# EAGLE schematic RGBLineSensor_Host (EAGLE 9.4.2)
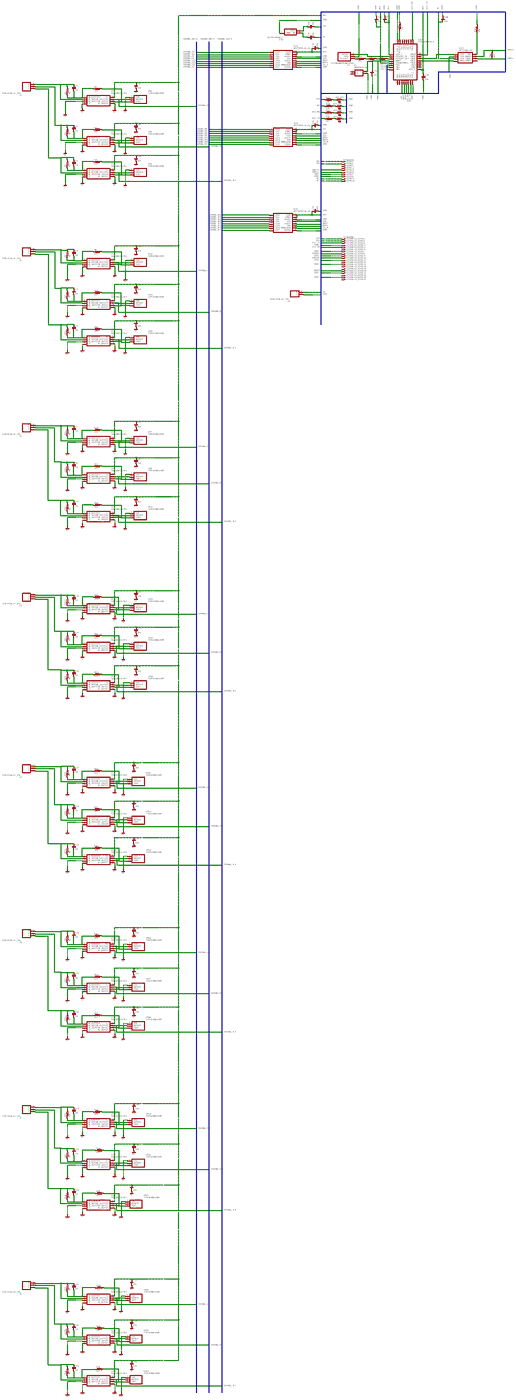
[diagram p0: schematic, sheet 1, overview]
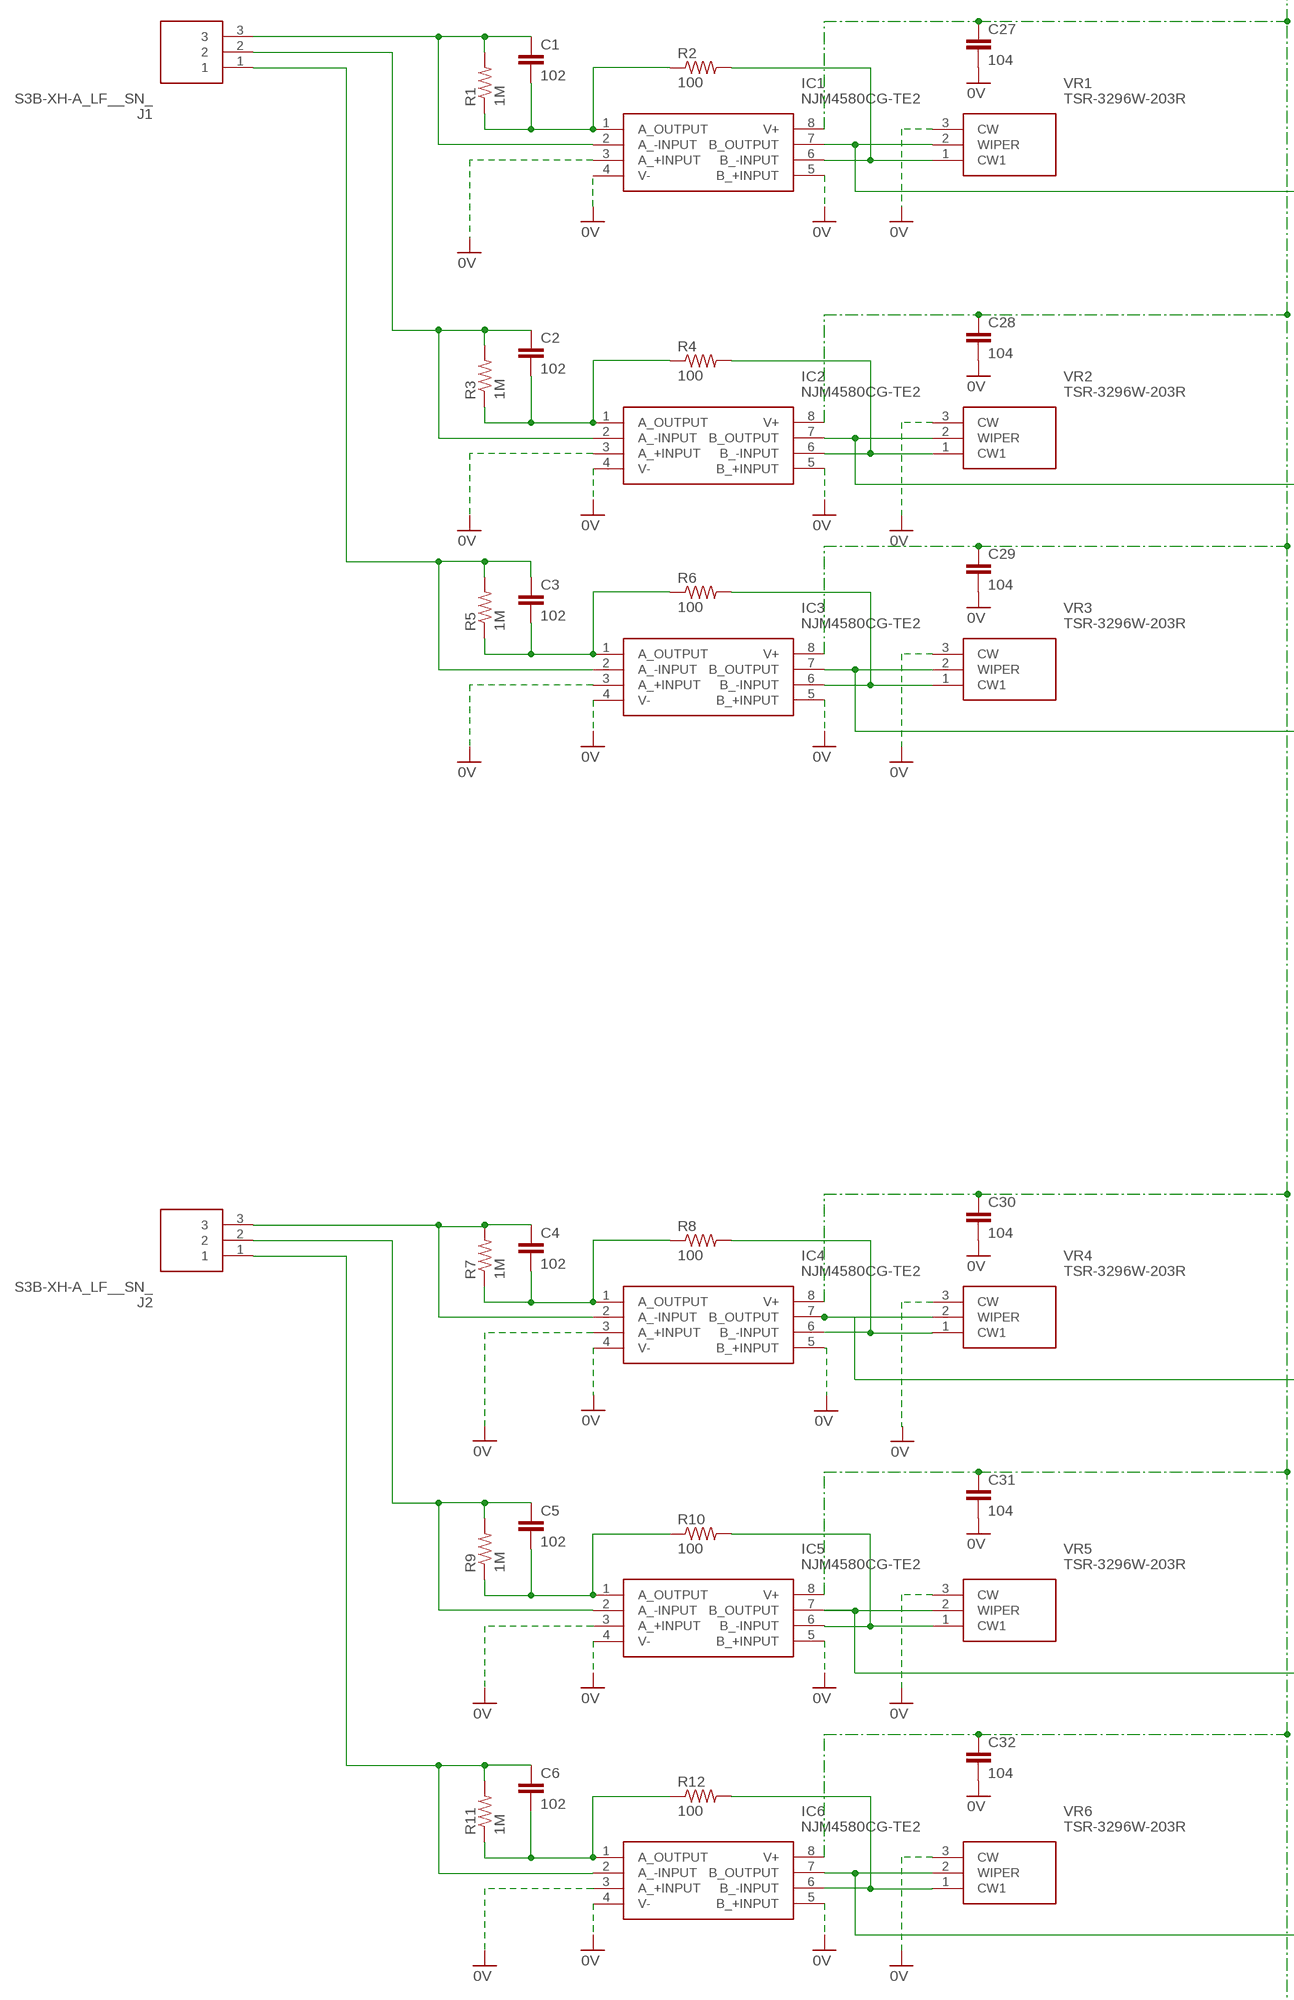
[diagram p1: schematic, sheet 1, part 1 of 5]
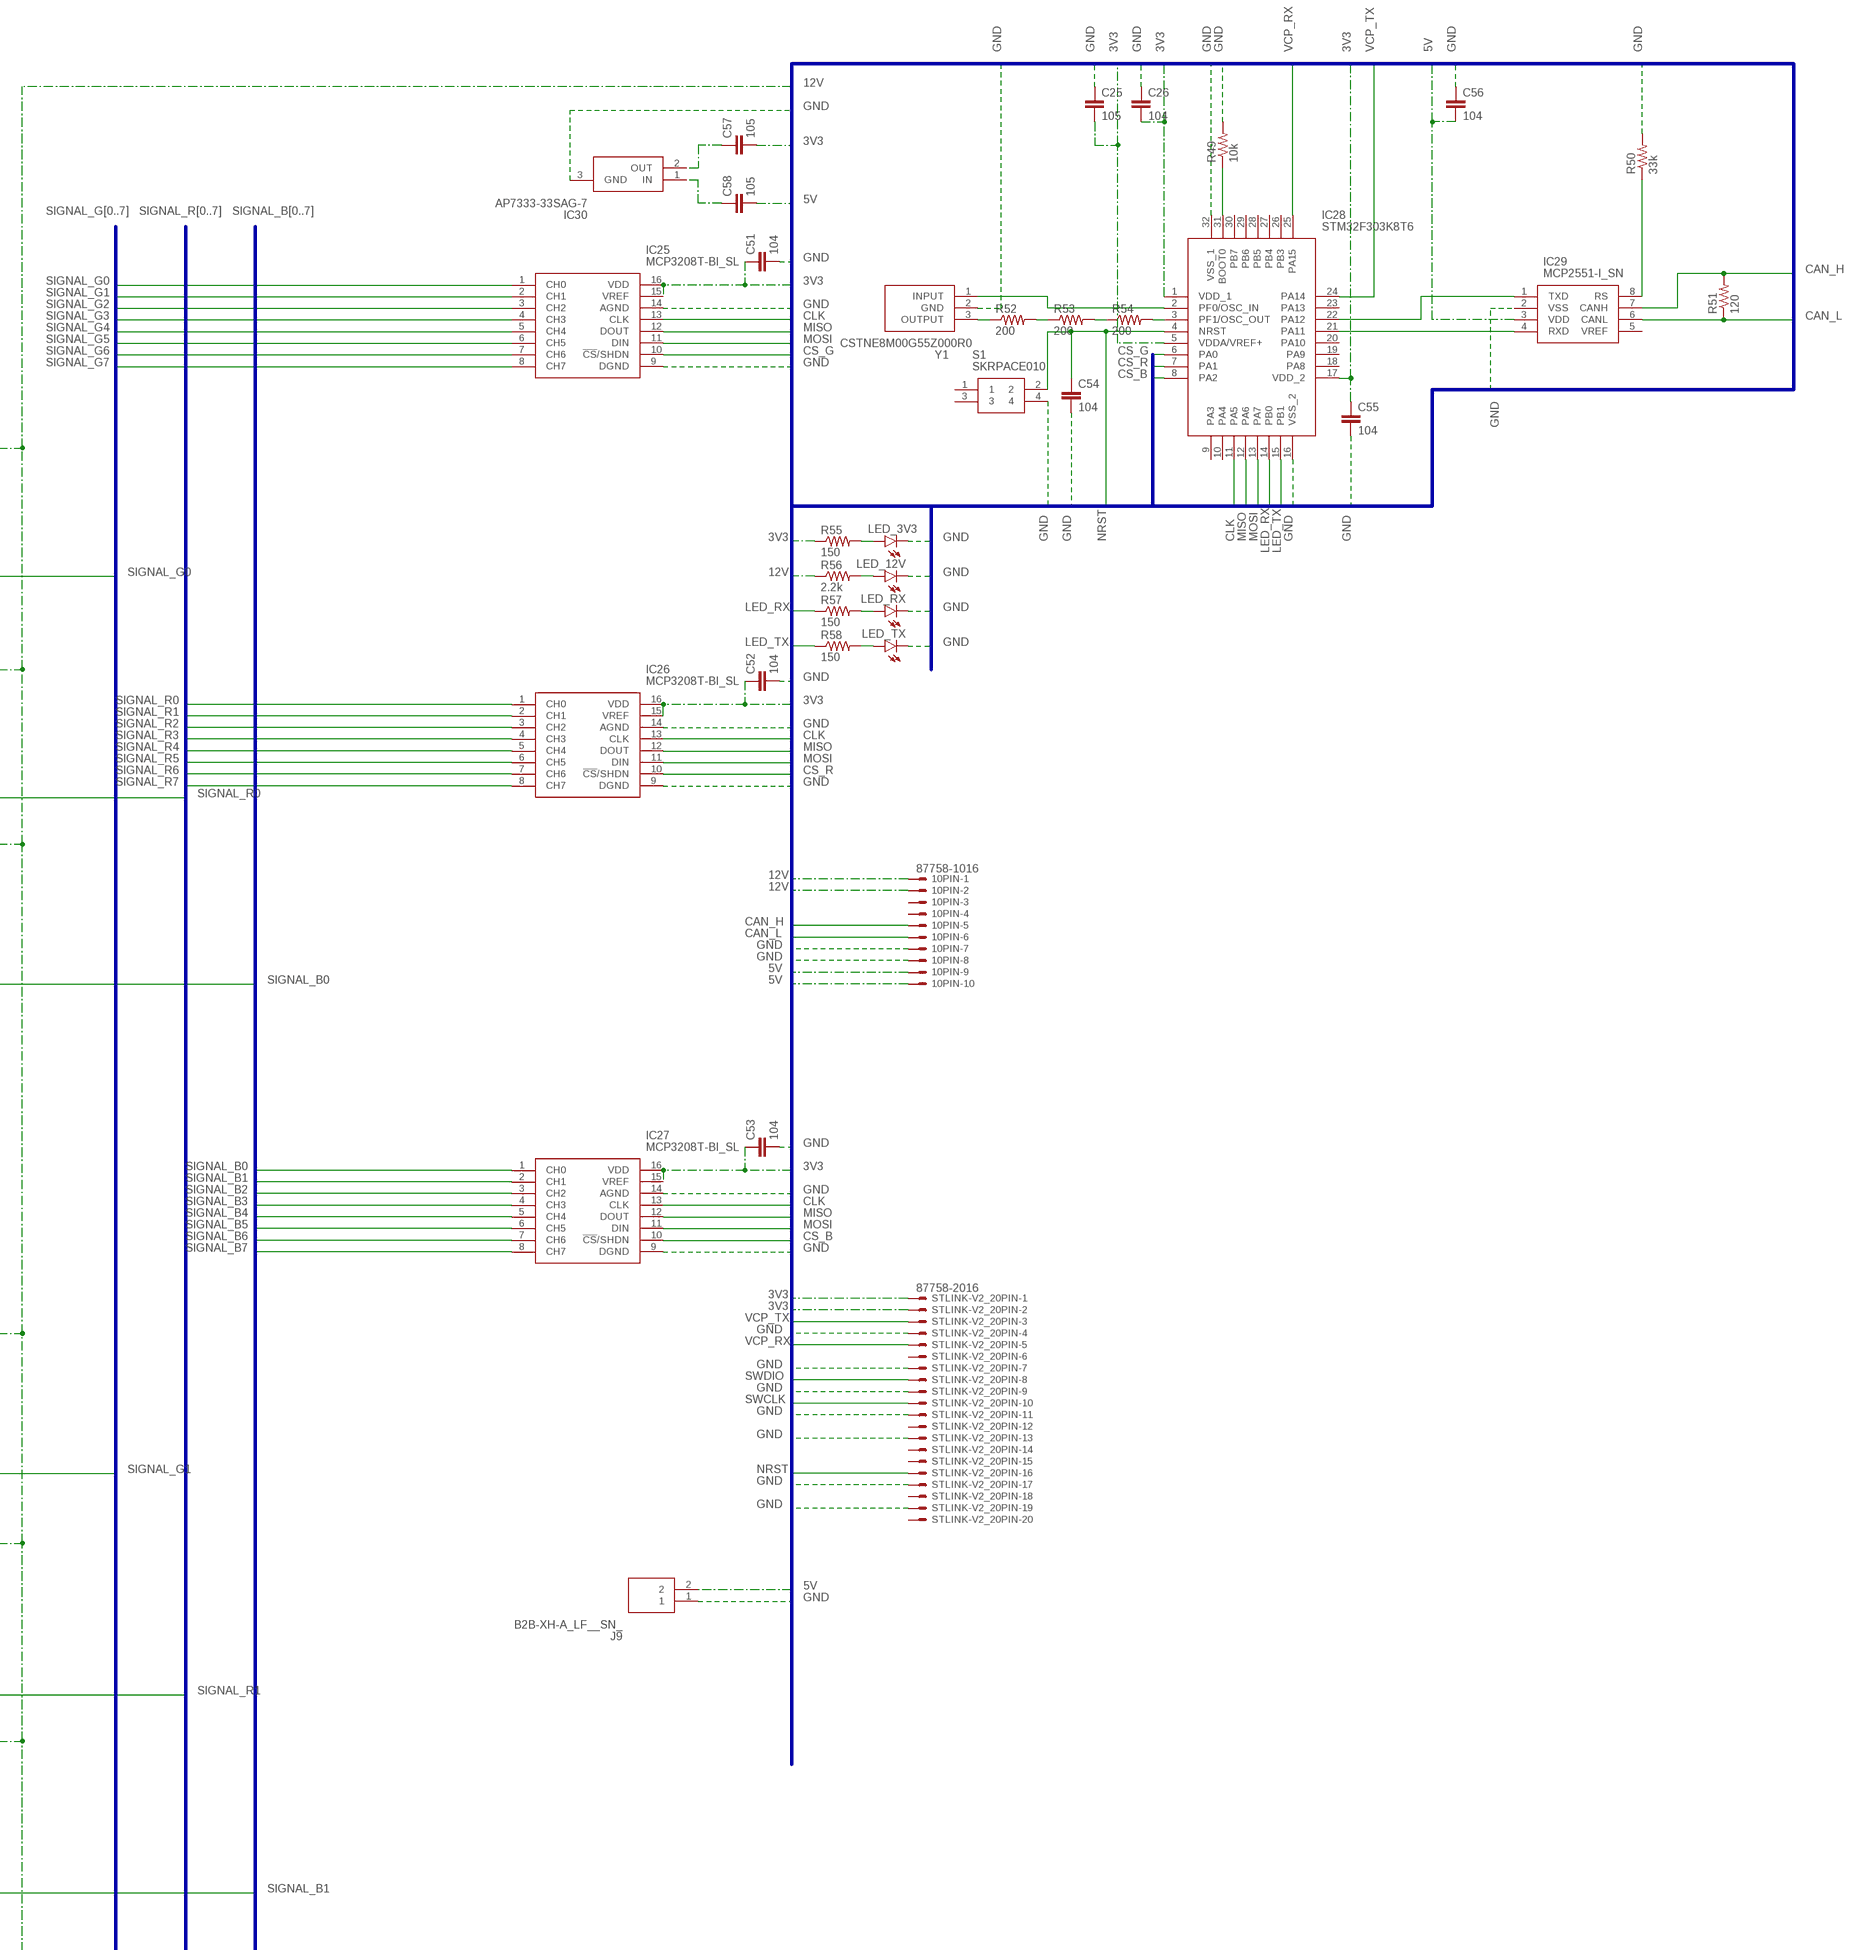
[diagram p2: schematic, sheet 1, part 2 of 5]
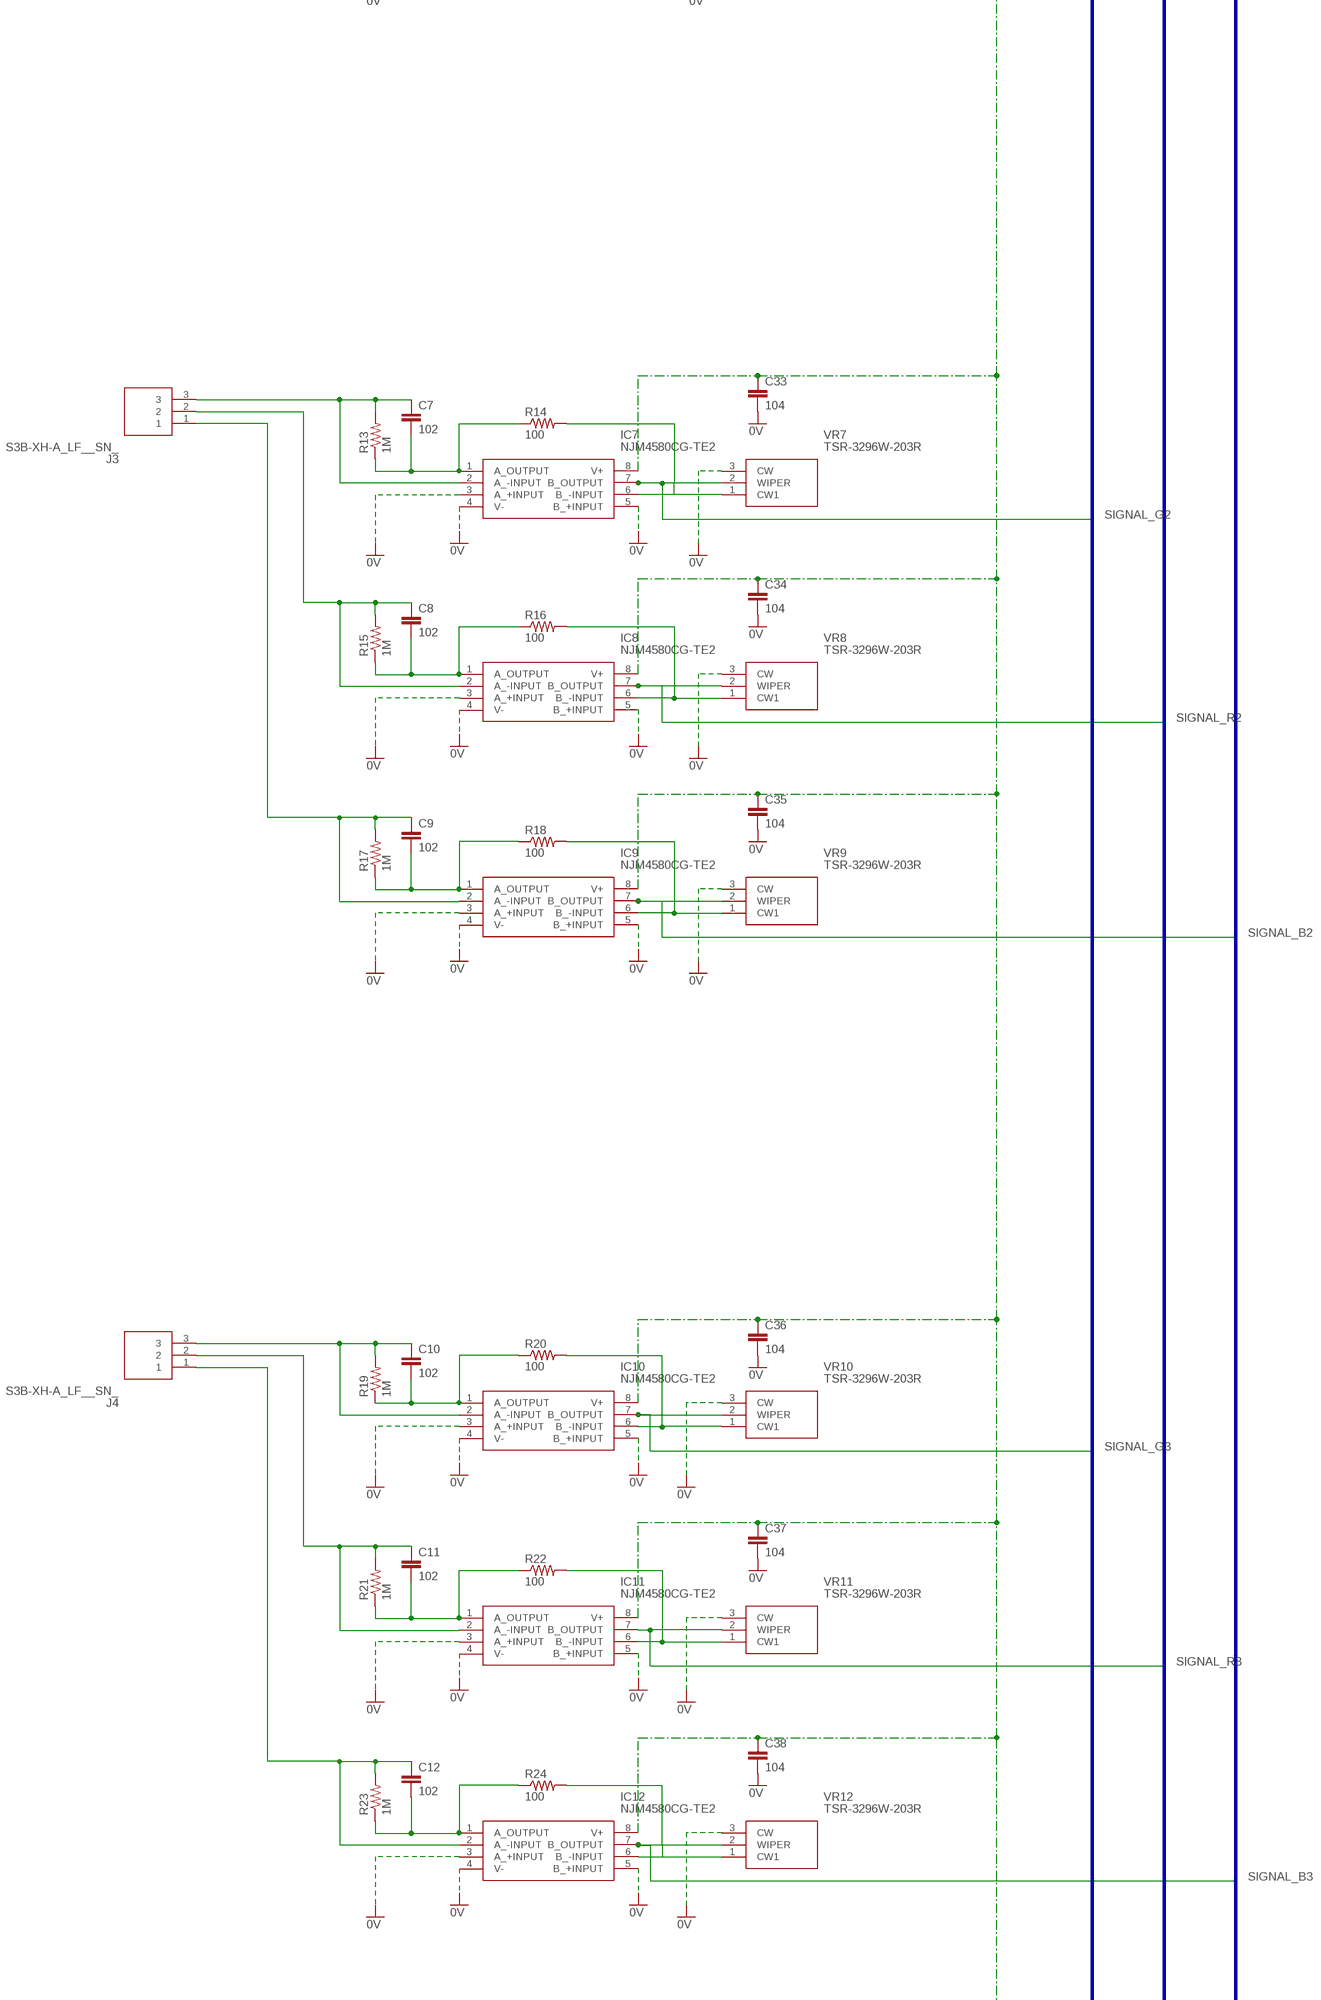
[diagram p3: schematic, sheet 1, part 3 of 5]
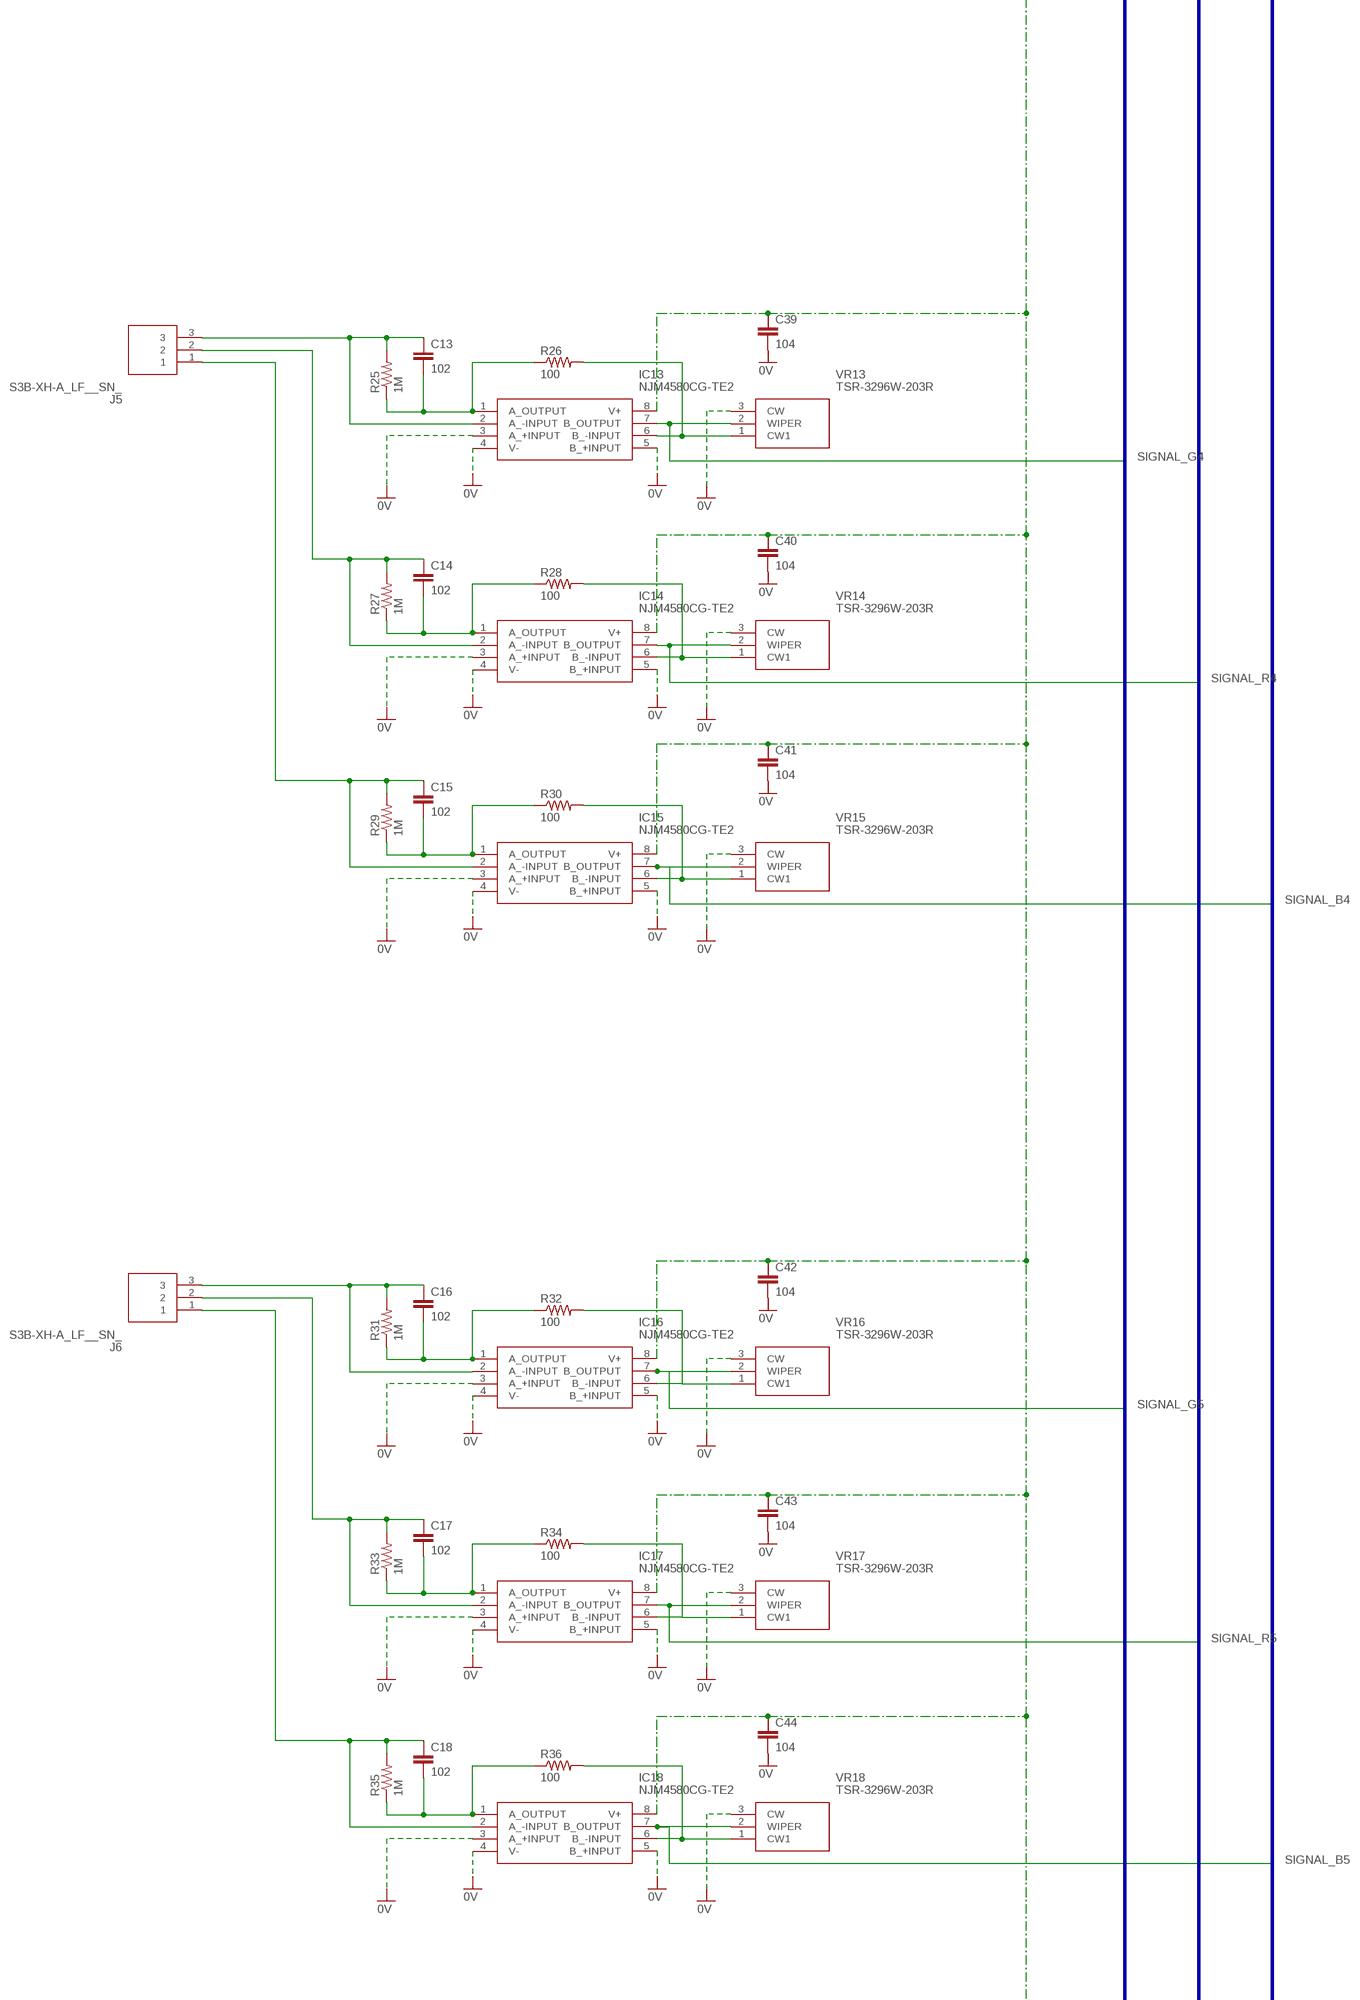
[diagram p4: schematic, sheet 1, part 4 of 5]
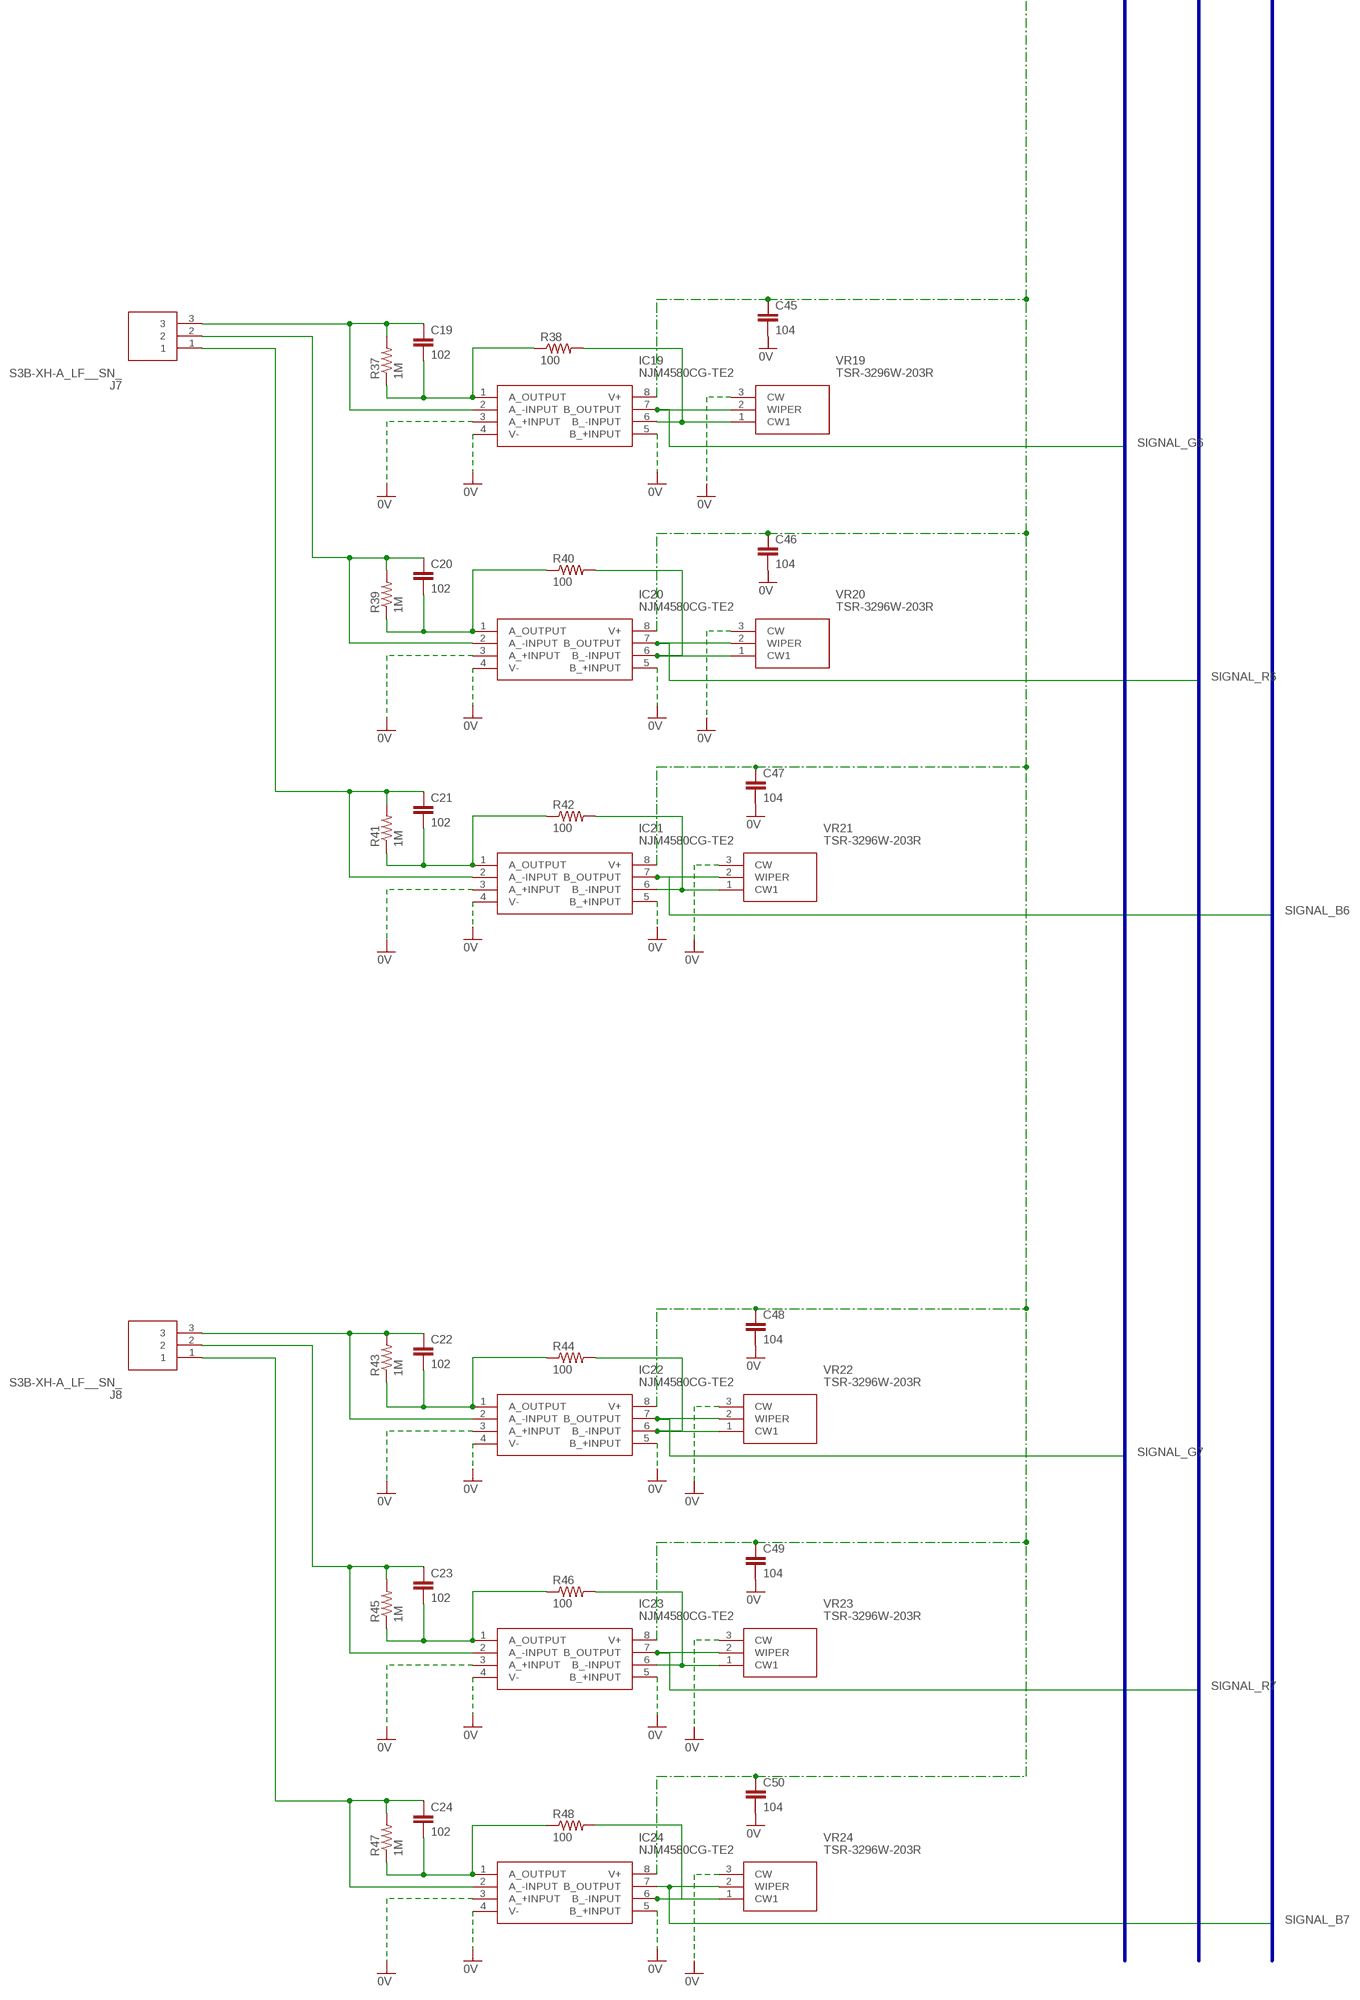
[diagram p5: schematic, sheet 1, part 5 of 5]

## Parts
10PIN  87758-1016  [87758-1016]
C1  102  C-EUC1608  [C1608]
C2  102  C-EUC1608  [C1608]
C3  102  C-EUC1608  [C1608]
C4  102  C-EUC1608  [C1608]
C5  102  C-EUC1608  [C1608]
C6  102  C-EUC1608  [C1608]
C7  102  C-EUC1608  [C1608]
C8  102  C-EUC1608  [C1608]
C9  102  C-EUC1608  [C1608]
C10  102  C-EUC1608  [C1608]
C11  102  C-EUC1608  [C1608]
C12  102  C-EUC1608  [C1608]
C13  102  C-EUC1608  [C1608]
C14  102  C-EUC1608  [C1608]
C15  102  C-EUC1608  [C1608]
C16  102  C-EUC1608  [C1608]
C17  102  C-EUC1608  [C1608]
C18  102  C-EUC1608  [C1608]
C19  102  C-EUC1608  [C1608]
C20  102  C-EUC1608  [C1608]
C21  102  C-EUC1608  [C1608]
C22  102  C-EUC1608  [C1608]
C23  102  C-EUC1608  [C1608]
C24  102  C-EUC1608  [C1608]
C25  105  C-EUC1608  [C1608]
C26  104  C-EUC1608  [C1608]
C27  104  C-EUC1608  [C1608]
C28  104  C-EUC1608  [C1608]
C29  104  C-EUC1608  [C1608]
C30  104  C-EUC1608  [C1608]
C31  104  C-EUC1608  [C1608]
C32  104  C-EUC1608  [C1608]
C33  104  C-EUC1608  [C1608]
C34  104  C-EUC1608  [C1608]
C35  104  C-EUC1608  [C1608]
C36  104  C-EUC1608  [C1608]
C37  104  C-EUC1608  [C1608]
C38  104  C-EUC1608  [C1608]
C39  104  C-EUC1608  [C1608]
C40  104  C-EUC1608  [C1608]
C41  104  C-EUC1608  [C1608]
C42  104  C-EUC1608  [C1608]
C43  104  C-EUC1608  [C1608]
C44  104  C-EUC1608  [C1608]
C45  104  C-EUC1608  [C1608]
C46  104  C-EUC1608  [C1608]
C47  104  C-EUC1608  [C1608]
C48  104  C-EUC1608  [C1608]
C49  104  C-EUC1608  [C1608]
C50  104  C-EUC1608  [C1608]
C51  104  C-EUC1608  [C1608]
C52  104  C-EUC1608  [C1608]
C53  104  C-EUC1608  [C1608]
C54  104  C-EUC1608  [C1608]
C55  104  C-EUC1608  [C1608]
C56  104  C-EUC1608  [C1608]
C57  105  C-EUC1608  [C1608]
C58  105  C-EUC1608  [C1608]
IC1  NJM4580CG-TE2  [SOIC127P600X175-8N]
IC2  NJM4580CG-TE2  [SOIC127P600X175-8N]
IC3  NJM4580CG-TE2  [SOIC127P600X175-8N]
IC4  NJM4580CG-TE2  [SOIC127P600X175-8N]
IC5  NJM4580CG-TE2  [SOIC127P600X175-8N]
IC6  NJM4580CG-TE2  [SOIC127P600X175-8N]
IC7  NJM4580CG-TE2  [SOIC127P600X175-8N]
IC8  NJM4580CG-TE2  [SOIC127P600X175-8N]
IC9  NJM4580CG-TE2  [SOIC127P600X175-8N]
IC10  NJM4580CG-TE2  [SOIC127P600X175-8N]
IC11  NJM4580CG-TE2  [SOIC127P600X175-8N]
IC12  NJM4580CG-TE2  [SOIC127P600X175-8N]
IC13  NJM4580CG-TE2  [SOIC127P600X175-8N]
IC14  NJM4580CG-TE2  [SOIC127P600X175-8N]
IC15  NJM4580CG-TE2  [SOIC127P600X175-8N]
IC16  NJM4580CG-TE2  [SOIC127P600X175-8N]
IC17  NJM4580CG-TE2  [SOIC127P600X175-8N]
IC18  NJM4580CG-TE2  [SOIC127P600X175-8N]
IC19  NJM4580CG-TE2  [SOIC127P600X175-8N]
IC20  NJM4580CG-TE2  [SOIC127P600X175-8N]
IC21  NJM4580CG-TE2  [SOIC127P600X175-8N]
IC22  NJM4580CG-TE2  [SOIC127P600X175-8N]
IC23  NJM4580CG-TE2  [SOIC127P600X175-8N]
IC24  NJM4580CG-TE2  [SOIC127P600X175-8N]
IC25  MCP3208T-BI_SL  [SOIC127P600X175-16N]
IC26  MCP3208T-BI_SL  [SOIC127P600X175-16N]
IC27  MCP3208T-BI_SL  [SOIC127P600X175-16N]
IC28  STM32F303K8T6  [QFP80P900X900X160-32N]
IC29  MCP2551-I_SN  [SOIC127P600X175-8N]
IC30  AP7333-33SAG-7  [SOT96P240X135-3N]
J1  S3B-XH-A_LF__SN_  [SHDRRA3W80P0X250_1X3_990X1150X]
J2  S3B-XH-A_LF__SN_  [SHDRRA3W80P0X250_1X3_990X1150X]
J3  S3B-XH-A_LF__SN_  [SHDRRA3W80P0X250_1X3_990X1150X]
J4  S3B-XH-A_LF__SN_  [SHDRRA3W80P0X250_1X3_990X1150X]
J5  S3B-XH-A_LF__SN_  [SHDRRA3W80P0X250_1X3_990X1150X]
J6  S3B-XH-A_LF__SN_  [SHDRRA3W80P0X250_1X3_990X1150X]
J7  S3B-XH-A_LF__SN_  [SHDRRA3W80P0X250_1X3_990X1150X]
J8  S3B-XH-A_LF__SN_  [SHDRRA3W80P0X250_1X3_990X1150X]
J9  B2B-XH-A_LF__SN_  [SHDR2W64P0X250_1X2_740X575X700]
LED_3V3  LEDCHIP-LED0603  [CHIP-LED0603]
LED_12V  LEDCHIP-LED0603  [CHIP-LED0603]
LED_RX  LEDCHIP-LED0603  [CHIP-LED0603]
LED_TX  LEDCHIP-LED0603  [CHIP-LED0603]
R1  1M  R-US_R0603  [R0603]
R2  100  R-US_R0603  [R0603]
R3  1M  R-US_R0603  [R0603]
R4  100  R-US_R0603  [R0603]
R5  1M  R-US_R0603  [R0603]
R6  100  R-US_R0603  [R0603]
R7  1M  R-US_R0603  [R0603]
R8  100  R-US_R0603  [R0603]
R9  1M  R-US_R0603  [R0603]
R10  100  R-US_R0603  [R0603]
R11  1M  R-US_R0603  [R0603]
R12  100  R-US_R0603  [R0603]
R13  1M  R-US_R0603  [R0603]
R14  100  R-US_R0603  [R0603]
R15  1M  R-US_R0603  [R0603]
R16  100  R-US_R0603  [R0603]
R17  1M  R-US_R0603  [R0603]
R18  100  R-US_R0603  [R0603]
R19  1M  R-US_R0603  [R0603]
R20  100  R-US_R0603  [R0603]
R21  1M  R-US_R0603  [R0603]
R22  100  R-US_R0603  [R0603]
R23  1M  R-US_R0603  [R0603]
R24  100  R-US_R0603  [R0603]
R25  1M  R-US_R0603  [R0603]
R26  100  R-US_R0603  [R0603]
R27  1M  R-US_R0603  [R0603]
R28  100  R-US_R0603  [R0603]
R29  1M  R-US_R0603  [R0603]
R30  100  R-US_R0603  [R0603]
R31  1M  R-US_R0603  [R0603]
R32  100  R-US_R0603  [R0603]
R33  1M  R-US_R0603  [R0603]
R34  100  R-US_R0603  [R0603]
R35  1M  R-US_R0603  [R0603]
R36  100  R-US_R0603  [R0603]
R37  1M  R-US_R0603  [R0603]
R38  100  R-US_R0603  [R0603]
R39  1M  R-US_R0603  [R0603]
R40  100  R-US_R0603  [R0603]
R41  1M  R-US_R0603  [R0603]
R42  100  R-US_R0603  [R0603]
R43  1M  R-US_R0603  [R0603]
R44  100  R-US_R0603  [R0603]
R45  1M  R-US_R0603  [R0603]
R46  100  R-US_R0603  [R0603]
R47  1M  R-US_R0603  [R0603]
R48  100  R-US_R0603  [R0603]
R49  10k  R-US_R0603  [R0603]
R50  33k  R-US_R0603  [R0603]
R51  120  R-US_R0603  [R0603]
R52  200  R-US_R0603  [R0603]
R53  200  R-US_R0603  [R0603]
R54  200  R-US_R0603  [R0603]
R55  150  R-US_R0603  [R0603]
R56  2.2k  R-US_R0603  [R0603]
R57  150  R-US_R0603  [R0603]
R58  150  R-US_R0603  [R0603]
S1  SKRPACE010  [SMT(4.2X3.2)]
STLINK-V2_20PIN  87758-2016  [87758-2016]
VR1  TSR-3296W-203R  [TSR3296W203R]
VR2  TSR-3296W-203R  [TSR3296W203R]
VR3  TSR-3296W-203R  [TSR3296W203R]
VR4  TSR-3296W-203R  [TSR3296W203R]
VR5  TSR-3296W-203R  [TSR3296W203R]
VR6  TSR-3296W-203R  [TSR3296W203R]
VR7  TSR-3296W-203R  [TSR3296W203R]
VR8  TSR-3296W-203R  [TSR3296W203R]
VR9  TSR-3296W-203R  [TSR3296W203R]
VR10  TSR-3296W-203R  [TSR3296W203R]
VR11  TSR-3296W-203R  [TSR3296W203R]
VR12  TSR-3296W-203R  [TSR3296W203R]
VR13  TSR-3296W-203R  [TSR3296W203R]
VR14  TSR-3296W-203R  [TSR3296W203R]
VR15  TSR-3296W-203R  [TSR3296W203R]
VR16  TSR-3296W-203R  [TSR3296W203R]
VR17  TSR-3296W-203R  [TSR3296W203R]
VR18  TSR-3296W-203R  [TSR3296W203R]
VR19  TSR-3296W-203R  [TSR3296W203R]
VR20  TSR-3296W-203R  [TSR3296W203R]
VR21  TSR-3296W-203R  [TSR3296W203R]
VR22  TSR-3296W-203R  [TSR3296W203R]
VR23  TSR-3296W-203R  [TSR3296W203R]
VR24  TSR-3296W-203R  [TSR3296W203R]
Y1  CSTNE8M00G55Z000R0  [CSTNE8M00G55Z000R0]

## Nets
0V: C27.2 C28.2 C29.2 C30.2 C31.2 C32.2 C33.2 C34.2 C35.2 C36.2 C37.2 C38.2 C39.2 C40.2 C41.2 C42.2 C43.2 C44.2 C45.2 C46.2 C47.2 C48.2 C49.2 C50.2 IC1.3(A_+INPUT) IC1.4(V-) IC1.5(B_+INPUT) IC2.3(A_+INPUT) IC2.4(V-) IC2.5(B_+INPUT) IC3.3(A_+INPUT) IC3.4(V-) IC3.5(B_+INPUT) IC4.3(A_+INPUT) IC4.4(V-) IC4.5(B_+INPUT) IC5.3(A_+INPUT) IC5.4(V-) IC5.5(B_+INPUT) IC6.3(A_+INPUT) IC6.4(V-) IC6.5(B_+INPUT) IC7.3(A_+INPUT) IC7.4(V-) IC7.5(B_+INPUT) IC8.3(A_+INPUT) IC8.4(V-) IC8.5(B_+INPUT) IC9.3(A_+INPUT) IC9.4(V-) IC9.5(B_+INPUT) IC10.3(A_+INPUT) IC10.4(V-) IC10.5(B_+INPUT) IC11.3(A_+INPUT) IC11.4(V-) IC11.5(B_+INPUT) IC12.3(A_+INPUT) IC12.4(V-) IC12.5(B_+INPUT) IC13.3(A_+INPUT) IC13.4(V-) IC13.5(B_+INPUT) IC14.3(A_+INPUT) IC14.4(V-) IC14.5(B_+INPUT) IC15.3(A_+INPUT) IC15.4(V-) IC15.5(B_+INPUT) IC16.3(A_+INPUT) IC16.4(V-) IC16.5(B_+INPUT) IC17.3(A_+INPUT) IC17.4(V-) IC17.5(B_+INPUT) IC18.3(A_+INPUT) IC18.4(V-) IC18.5(B_+INPUT) IC19.3(A_+INPUT) IC19.4(V-) IC19.5(B_+INPUT) IC20.3(A_+INPUT) IC20.4(V-) IC20.5(B_+INPUT) IC21.3(A_+INPUT) IC21.4(V-) IC21.5(B_+INPUT) IC22.3(A_+INPUT) IC22.4(V-) IC22.5(B_+INPUT) IC23.3(A_+INPUT) IC23.4(V-) IC23.5(B_+INPUT) IC24.3(A_+INPUT) IC24.4(V-) IC24.5(B_+INPUT) VR1.3(CW) VR2.3(CW) VR3.3(CW) VR4.3(CW) VR5.3(CW) VR6.3(CW) VR7.3(CW) VR8.3(CW) VR9.3(CW) VR10.3(CW) VR11.3(CW) VR12.3(CW) VR13.3(CW) VR14.3(CW) VR15.3(CW) VR16.3(CW) VR17.3(CW) VR18.3(CW) VR19.3(CW) VR20.3(CW) VR21.3(CW) VR22.3(CW) VR23.3(CW) VR24.3(CW)
3V3: C25.2 C26.2 C51.1 C52.1 C53.1 C55.1 C57.2 IC25.15(VREF) IC25.16(VDD) IC26.15(VREF) IC26.16(VDD) IC27.15(VREF) IC27.16(VDD) IC28.1(VDD_1) IC28.5(VDDA/VREF+) IC28.17(VDD_2) R55.1 STLINK-V2_20PIN.1 STLINK-V2_20PIN.2
5V: 10PIN.9 10PIN.10 C56.2 C58.2 IC29.3(VDD) J9.2
12V: 10PIN.1 10PIN.2 C27.1 C28.1 C29.1 C30.1 C31.1 C32.1 C33.1 C34.1 C35.1 C36.1 C37.1 C38.1 C39.1 C40.1 C41.1 C42.1 C43.1 C44.1 C45.1 C46.1 C47.1 C48.1 C49.1 C50.1 IC1.8(V+) IC2.8(V+) IC3.8(V+) IC4.8(V+) IC5.8(V+) IC6.8(V+) IC7.8(V+) IC8.8(V+) IC9.8(V+) IC10.8(V+) IC11.8(V+) IC12.8(V+) IC13.8(V+) IC14.8(V+) IC15.8(V+) IC16.8(V+) IC17.8(V+) IC18.8(V+) IC19.8(V+) IC20.8(V+) IC21.8(V+) IC22.8(V+) IC23.8(V+) IC24.8(V+) R56.1
CAN_H: 10PIN.5 IC29.7(CANH) R51.2
CAN_L: 10PIN.6 IC29.6(CANL) R51.1
CLK: IC25.13(CLK) IC26.13(CLK) IC27.13(CLK) IC28.11(PA5)
CS_B: IC27.10(!CS!/SHDN) IC28.8(PA2)
CS_G: IC25.10(!CS!/SHDN) IC28.6(PA0)
CS_R: IC26.10(!CS!/SHDN) IC28.7(PA1)
GND: 10PIN.7 10PIN.8 C25.1 C26.1 C51.2 C52.2 C53.2 C54.2 C55.2 C56.1 IC25.9(DGND) IC25.14(AGND) IC26.9(DGND) IC26.14(AGND) IC27.9(DGND) IC27.14(AGND) IC28.16(VSS_2) IC28.32(VSS_1) IC29.2(VSS) IC30.3(GND) J9.1 LED_3V3.C LED_12V.C LED_RX.C LED_TX.C R49.2 R50.2 S1.4 STLINK-V2_20PIN.4 STLINK-V2_20PIN.7 STLINK-V2_20PIN.9 STLINK-V2_20PIN.11 STLINK-V2_20PIN.13 STLINK-V2_20PIN.17 STLINK-V2_20PIN.19 Y1.2(GND)
LED_RX: IC28.14(PB0) R57.1
LED_TX: IC28.15(PB1) R58.1
MISO: IC25.12(DOUT) IC26.12(DOUT) IC27.12(DOUT) IC28.12(PA6)
MOSI: IC25.11(DIN) IC26.11(DIN) IC27.11(DIN) IC28.13(PA7)
N$1: C1.1 IC1.2(A_-INPUT) J1.3 R1.2
N$2 [power]: C57.1 IC30.2(OUT)
N$3: C1.2 IC1.1(A_OUTPUT) R1.1 R2.1
N$4: C7.1 IC7.2(A_-INPUT) J3.3 R13.2
N$5: IC1.6(B_-INPUT) R2.2 VR1.1(CW1)
N$6: IC28.22(PA12) IC29.1(TXD)
N$7: C2.2 IC2.1(A_OUTPUT) R3.1 R4.1
N$8: C2.1 IC2.2(A_-INPUT) J1.2 R3.2
N$9: IC2.6(B_-INPUT) R4.2 VR2.1(CW1)
N$10: IC28.21(PA11) IC29.4(RXD)
N$11: C3.2 IC3.1(A_OUTPUT) R5.1 R6.1
N$12: C7.2 IC7.1(A_OUTPUT) R13.1 R14.1
N$13: IC3.6(B_-INPUT) R6.2 VR3.1(CW1)
N$14: IC29.8(RS) R50.1
N$15: C4.1 IC4.2(A_-INPUT) J2.3 R7.2
N$16: C3.1 IC3.2(A_-INPUT) J1.1 R5.2
N$17: C4.2 IC4.1(A_OUTPUT) R7.1 R8.1
N$18: IC6.6(B_-INPUT) R12.2 VR6.1(CW1)
N$19: IC10.6(B_-INPUT) R20.2 VR10.1(CW1)
N$20: IC8.6(B_-INPUT) R16.2 VR8.1(CW1)
N$21: IC9.6(B_-INPUT) R18.2 VR9.1(CW1)
N$22: IC11.6(B_-INPUT) R22.2 VR11.1(CW1)
N$23: IC13.6(B_-INPUT) R26.2 VR13.1(CW1)
N$24: IC24.6(B_-INPUT) R48.2 VR24.1(CW1)
N$25: C5.1 IC5.2(A_-INPUT) J2.2 R9.2
N$26: C5.2 IC5.1(A_OUTPUT) R9.1 R10.1
N$27: IC14.6(B_-INPUT) R28.2 VR14.1(CW1)
N$28: IC16.6(B_-INPUT) R32.2 VR16.1(CW1)
N$29: IC5.6(B_-INPUT) R10.2 VR5.1(CW1)
N$30: IC18.6(B_-INPUT) R36.2 VR18.1(CW1)
N$31: IC15.6(B_-INPUT) R30.2 VR15.1(CW1)
N$32: IC23.6(B_-INPUT) R46.2 VR23.1(CW1)
N$33: C6.2 IC6.1(A_OUTPUT) R11.1 R12.1
N$35: IC21.6(B_-INPUT) R42.2 VR21.1(CW1)
N$36: C24.1 IC24.2(A_-INPUT) J8.1 R47.2
N$37: IC28.31(BOOT0) R49.1
N$38: C6.1 IC6.2(A_-INPUT) J2.1 R11.2
N$39: R52.1 Y1.3(OUTPUT)
N$40: IC22.6(B_-INPUT) R44.2 VR22.1(CW1)
N$41: C24.2 IC24.1(A_OUTPUT) R47.1 R48.1
N$42: C8.1 IC8.2(A_-INPUT) J3.2 R15.2
N$43: C8.2 IC8.1(A_OUTPUT) R15.1 R16.1
N$44: C9.2 IC9.1(A_OUTPUT) R17.1 R18.1
N$45: IC17.6(B_-INPUT) R34.2 VR17.1(CW1)
N$46 [power]: C58.1 IC30.1(IN)
N$47: C22.2 IC22.1(A_OUTPUT) R43.1 R44.1
N$48: LED_3V3.A R55.2
N$49: R52.2 R53.1
N$50: C9.1 IC9.2(A_-INPUT) J3.1 R17.2
N$51: IC4.6(B_-INPUT) R8.2 VR4.1(CW1)
N$52: C10.1 IC10.2(A_-INPUT) J4.3 R19.2
N$53: IC19.6(B_-INPUT) R38.2 VR19.1(CW1)
N$54: R53.2 R54.1
N$55: C10.2 IC10.1(A_OUTPUT) R19.1 R20.1
N$56: IC28.3(PF1/OSC_OUT) R54.2
N$57: C11.1 IC11.2(A_-INPUT) J4.2 R21.2
N$58: C11.2 IC11.1(A_OUTPUT) R21.1 R22.1
N$59: IC20.6(B_-INPUT) R40.2 VR20.1(CW1)
N$62: IC28.2(PF0/OSC_IN) Y1.1(INPUT)
N$63: IC12.6(B_-INPUT) R24.2 VR12.1(CW1)
N$64: IC7.6(B_-INPUT) R14.2 VR7.1(CW1)
N$68: C12.2 IC12.1(A_OUTPUT) R23.1 R24.1
N$71: LED_12V.A R56.2
N$72: C16.1 IC16.2(A_-INPUT) J6.3 R31.2
N$73: C13.1 IC13.2(A_-INPUT) J5.3 R25.2
N$74: C13.2 IC13.1(A_OUTPUT) R25.1 R26.1
N$75: C12.1 IC12.2(A_-INPUT) J4.1 R23.2
N$76: C14.1 IC14.2(A_-INPUT) J5.2 R27.2
N$79: LED_RX.A R57.2
N$81: C14.2 IC14.1(A_OUTPUT) R27.1 R28.1
N$85: C15.1 IC15.2(A_-INPUT) J5.1 R29.2
N$86: LED_TX.A R58.2
N$87: C15.2 IC15.1(A_OUTPUT) R29.1 R30.1
N$88: C16.2 IC16.1(A_OUTPUT) R31.1 R32.1
N$94: C17.1 IC17.2(A_-INPUT) J6.2 R33.2
N$96: C17.2 IC17.1(A_OUTPUT) R33.1 R34.1
N$103: C19.1 IC19.2(A_-INPUT) J7.3 R37.2
N$104: C18.2 IC18.1(A_OUTPUT) R35.1 R36.1
N$105: C18.1 IC18.2(A_-INPUT) J6.1 R35.2
N$107: C19.2 IC19.1(A_OUTPUT) R37.1 R38.1
N$111: C20.1 IC20.2(A_-INPUT) J7.2 R39.2
N$112: C20.2 IC20.1(A_OUTPUT) R39.1 R40.1
N$118: C21.2 IC21.1(A_OUTPUT) R41.1 R42.1
N$123: C21.1 IC21.2(A_-INPUT) J7.1 R41.2
N$125: C23.1 IC23.2(A_-INPUT) J8.2 R45.2
N$132: C23.2 IC23.1(A_OUTPUT) R45.1 R46.1
N$139: C22.1 IC22.2(A_-INPUT) J8.3 R43.2
NRST: C54.1 IC28.4(NRST) S1.2 STLINK-V2_20PIN.16
SIGNAL_B0: IC3.7(B_OUTPUT) IC27.1(CH0) VR3.2(WIPER)
SIGNAL_B1: IC6.7(B_OUTPUT) IC27.2(CH1) VR6.2(WIPER)
SIGNAL_B2: IC9.7(B_OUTPUT) IC27.3(CH2) VR9.2(WIPER)
SIGNAL_B3: IC12.7(B_OUTPUT) IC27.4(CH3) VR12.2(WIPER)
SIGNAL_B4: IC15.7(B_OUTPUT) IC27.5(CH4) VR15.2(WIPER)
SIGNAL_B5: IC18.7(B_OUTPUT) IC27.6(CH5) VR18.2(WIPER)
SIGNAL_B6: IC21.7(B_OUTPUT) IC27.7(CH6) VR21.2(WIPER)
SIGNAL_B7: IC24.7(B_OUTPUT) IC27.8(CH7) VR24.2(WIPER)
SIGNAL_G0: IC1.7(B_OUTPUT) IC25.1(CH0) VR1.2(WIPER)
SIGNAL_G1: IC4.7(B_OUTPUT) IC25.2(CH1) VR4.2(WIPER)
SIGNAL_G2: IC7.7(B_OUTPUT) IC25.3(CH2) VR7.2(WIPER)
SIGNAL_G3: IC10.7(B_OUTPUT) IC25.4(CH3) VR10.2(WIPER)
SIGNAL_G4: IC13.7(B_OUTPUT) IC25.5(CH4) VR13.2(WIPER)
SIGNAL_G5: IC16.7(B_OUTPUT) IC25.6(CH5) VR16.2(WIPER)
SIGNAL_G6: IC19.7(B_OUTPUT) IC25.7(CH6) VR19.2(WIPER)
SIGNAL_G7: IC22.7(B_OUTPUT) IC25.8(CH7) VR22.2(WIPER)
SIGNAL_R0: IC2.7(B_OUTPUT) IC26.1(CH0) VR2.2(WIPER)
SIGNAL_R1: IC5.7(B_OUTPUT) IC26.2(CH1) VR5.2(WIPER)
SIGNAL_R2: IC8.7(B_OUTPUT) IC26.3(CH2) VR8.2(WIPER)
SIGNAL_R3: IC11.7(B_OUTPUT) IC26.4(CH3) VR11.2(WIPER)
SIGNAL_R4: IC14.7(B_OUTPUT) IC26.5(CH4) VR14.2(WIPER)
SIGNAL_R5: IC17.7(B_OUTPUT) IC26.6(CH5) VR17.2(WIPER)
SIGNAL_R6: IC20.7(B_OUTPUT) IC26.7(CH6) VR20.2(WIPER)
SIGNAL_R7: IC23.7(B_OUTPUT) IC26.8(CH7) VR23.2(WIPER)
SWCLK: STLINK-V2_20PIN.10
SWDIO: STLINK-V2_20PIN.8
VCP_RX: IC28.25(PA15) STLINK-V2_20PIN.5
VCP_TX: IC28.24(PA14) STLINK-V2_20PIN.3
Unconnected: 10PIN.3 10PIN.4 IC28.9(PA3) IC28.10(PA4) IC28.18(PA8) IC28.19(PA9) IC28.20(PA10) IC28.23(PA13) IC28.26(PB3) IC28.27(PB4) IC28.28(PB5) IC28.29(PB6) IC28.30(PB7) IC29.5(VREF) S1.1 S1.3 STLINK-V2_20PIN.6 STLINK-V2_20PIN.12 STLINK-V2_20PIN.14 STLINK-V2_20PIN.15 STLINK-V2_20PIN.18 STLINK-V2_20PIN.20

## Buses
SIGNAL_G[0..7]
SIGNAL_R[0..7]
SIGNAL_B[0..7]
3V3,5V,12V,CAN_H,CAN_L,CLK,CS_B,CS_G,CS_R,GND,LED_RX,LED_TX,MISO,MOSI,NRST,SWCLK,SWDIO,VCP_RX,VCP_TX

## Library data of the parts
10PIN = con-molex:87758-1016: 10 Pin - 2mm Dual Row Single Wafer, Vertical T/H HDR Source: http://www.molex.com/pdm_docs/sd/877580616_sd.pdf; MF: MOLEX; MPN: 87758-1016; OC_FARNELL: 7472340; OC_NEWARK: 59J1558
C1-C58 = rcl:C-EU: CAPACITOR, European symbol; SPICEPREFIX: C
IC1-IC24 = NJM4580CG-TE2:NJM4580CG-TE2: Operational Amplifiers - Op Amps Dual Op Amp 2 to 18V 5nV 15MHz 5V Source: Datasheet <https://www.njr.com/semicon/PDF/NJM4580C_E.pdf>; DESCRIPTION: Operational Amplifiers - Op Amps Dual Op Amp 2 to 18V 5nV 15MHz 5V; HEIGHT: 1.75mm; MANUFACTURER_NAME: NJR; MANUFACTURER_PART_NUMBER: NJM4580CG-TE2
IC25-IC27 = MCP3208T-BI_SL:MCP3208T-BI_SL: Analog to Digital Converters - ADC 12-bit SPI 8 Chl Source: Datasheet <http://ww1.microchip.com/downloads/en/DeviceDoc/21298e.pdf>; ALLIED_NUMBER: 70454283; DESCRIPTION: Analog to Digital Converters - ADC 12-bit SPI 8 Chl; HEIGHT: 1.75mm; MANUFACTURER_NAME: Microchip; MANUFACTURER_PART_NUMBER: MCP3208T-BI/SL
IC28 = STM32F303K8T6:STM32F303K8T6: ARM Microcontrollers - MCU 16/32-BITS MICROS Source: Datasheet; DESCRIPTION: ARM Microcontrollers - MCU 16/32-BITS MICROS; HEIGHT: 1.6mm; MANUFACTURER_NAME: STMicroelectronics; MANUFACTURER_PART_NUMBER: STM32F303K8T6
IC29 = MCP2551-I_SN:MCP2551-I_SN: High Speed CAN Transceiver,MCP2551-I/SN Source: Datasheet <http://uk.rs-online.com/web/p/products/0402904P>; ALLIED_NUMBER: 70045403; DESCRIPTION: High Speed CAN Transceiver,MCP2551-I/SN; HEIGHT: 1.75mm; MANUFACTURER_NAME: Microchip; MANUFACTURER_PART_NUMBER: MCP2551-I/SN; RS_PART_NUMBER: 0402904P; RS_PRICE-STOCK: http://uk.rs-online.com/web/p/products/0402904P
IC30 = AP7333-33SAG-7:AP7333-33SAG-7: LDO Regulator Pos 3.3V 0.3A 3Pin SOT23 Diodes Inc AP7333 AP7333-33SAG-7, Single Linear Voltage Regulator, 300mA 3.3 V, +/-2%, 3-Pin SOT-23 Source: Datasheet <http://uk.rs-online.com/web/p/products/7513102P>; ALLIED_NUMBER: 70437471; DESCRIPTION: LDO Regulator Pos 3.3V 0.3A 3Pin SOT23 Diodes Inc AP7333 AP7333-33SAG-7, Single Linear Voltage Regulator, 300mA 3.3 V, +/-2%, 3-Pin SOT-23; HEIGHT: 1.35mm; MANUFACTURER_NAME: Diodes Inc.; MANUFACTURER_PART_NUMBER: AP7333-33SAG-7; RS_PART_NUMBER: 7513102P; RS_PRICE-STOCK: http://uk.rs-online.com/web/p/products/7513102P
J1-J8 = S3B-XH-A_LF__SN_:S3B-XH-A_LF__SN_: XH-2.5mm Header side entry 3 way JST XH Series, Series Number S3B, 2.5mm Pitch 3 Way 1 Row Right Angle PCB Header, Solder Termination, 3A Source: Datasheet <http://uk.rs-online.com/web/p/products/8201585P>; DESCRIPTION: XH-2.5mm Header side entry 3 way JST XH Series, Series Number S3B, 2.5mm Pitch 3 Way 1 Row Right Angle PCB Header, Solder Termination, 3A; HEIGHT: 6.1mm; MANUFACTURER_NAME: JST (JAPAN SOLDERLESS TERMINALS); MANUFACTURER_PART_NUMBER: S3B-XH-A(LF)(SN); RS_PART_NUMBER: 8201585P; RS_PRICE-STOCK: http://uk.rs-online.com/web/p/products/8201585P
J9 = B2B-XH-A_LF__SN_:B2B-XH-A_LF__SN_: JST XH Series, 2.5mm Pitch 2 Way 1 Row Straight PCB Header, Solder Termination, 3A Source: Datasheet <http://uk.rs-online.com/web/p/products/8201554P>; DESCRIPTION: JST XH Series, 2.5mm Pitch 2 Way 1 Row Straight PCB Header, Solder Termination, 3A; HEIGHT: 7mm; MANUFACTURER_NAME: JST (JAPAN SOLDERLESS TERMINALS); MANUFACTURER_PART_NUMBER: B2B-XH-A(LF)(SN); RS_PART_NUMBER: 8201554P; RS_PRICE-STOCK: http://uk.rs-online.com/web/p/products/8201554P
LED_3V3 LED_12V LED_RX LED_TX = led:LED: LED OSRAM: - CHIPLED LG R971, LG N971, LY N971, LG Q971, LY Q971, LO R971, LY R971 LH N974, LH R974 LS Q976, LO Q976, LY Q976 LO Q996 - Hyper CHIPLED LW Q18S LB Q993, LB Q99A, LB R99A - SideLED LS A670, LO A670, LY A670, LG A670, LP A670 LB A673, LV A673, LT A673, LW A673 LH A674 LY A675 LS A676, LA A676, LO A676, LY A676, LW A676 LS A679, LY A679, LG A679 - Hyper Micro SIDELED® LS Y876, LA Y876, LO Y876, LY Y876 LT Y87S - SmartLED LW L88C, LW L88S LB L89C, LB L89S, LG L890 LS L89K, LO L89K, LY L89K LS L896, LA L896, LO L896, LY L896 - TOPLED LS T670, LO T670, LY T670, LG T670, LP T670 LSG T670, LSP T670, LSY T670, LOP T670, LYG T670 LG T671, LOG T671, LSG T671 LB T673, LV T673, LT T673, LW T673 LH T674 LS T676, LA T676, LO T676, LY T676, LB T676, LH T676, LSB T676, LW T676 LB T67C, LV T67C, LT T67C, LS T67K, LO T67K, LY T67K, LW E67C LS E67B, LA E67B, LO E67B, LY E67B, LB E67C, LV E67C, LT E67C LW T67C LS T679, LY T679, LG T679 LS T770, LO T770, LY T770, LG T770, LP T770 LB T773, LV T773, LT T773, LW T773 LH T774 LS E675, LA E675, LY E675, LS T675 LS T776, LA T776, LO T776, LY T776, LB T776 LHGB T686 LT T68C, LB T68C - Hyper Mini TOPLED® LB M676 - Mini TOPLED Santana® LG M470 LS M47K, LO M47K, LY M47K Source: http://www.osram.convergy.de LUXEON: - LUMILED® LXK2-PW12-R00, LXK2-PW12-S00, LXK2-PW14-U00, LXK2-PW14-V00 LXK2-PM12-R00, LXK2-PM12-S00, LXK2-PM14-U00 LXK2-PE12-Q00, LXK2-PE12-R00, LXK2-PE12-S00, LXK2-PE14-T00, LXK2-PE14-U00 LXK2-PB12-K00, LXK2-PB12-L00, LXK2-PB12-M00, LXK2-PB14-N00, LXK2-PB14-P00, LXK2-PB14-Q00 LXK2-PR12-L00, LXK2-PR12-M00, LXK2-PR14-Q00, LXK2-PR14-R00 LXK2-PD12-Q00, LXK2-PD12-R00, LXK2-PD12-S00 LXK2-PH12-R00, LXK2-PH12-S00 LXK2-PL12-P00, LXK2-PL12-Q00, LXK2-PL12-R00 Source: www.luxeon.com KINGBRIGHT: KA-3528ASYC Source: www.kingbright.com
R1-R58 = rcl:R-US_: RESISTOR, American symbol; SPICEPREFIX: R
S1 = SKRPACE010:SKRPACE010: Tactile Switches 4.2x3.2x2.5mm 260gf Source: Datasheet <http://www.alps.com/prod/info/E/HTML/Tact/SurfaceMount/SKRP/SKRPACE010.html>; DESCRIPTION: Tactile Switches 4.2x3.2x2.5mm 260gf; HEIGHT: mm; MANUFACTURER_NAME: ALPS; MANUFACTURER_PART_NUMBER: SKRPACE010
STLINK-V2_20PIN = con-molex:87758-2016: 20 Pin - 2mm Dual Row Single Wafer, Vertical T/H HDR Source: http://www.molex.com/pdm_docs/sd/877580616_sd.pdf; MF: MOLEX; MPN: 87758-2016; OC_FARNELL: 7472374; OC_NEWARK: 25M5677
VR1-VR24 = TSR-3296W-203R:TSR-3296W-203R: Swquare Trimming Potentionmeter Source: Datasheet <http://akizukidenshi.com/download/ds/suntan/TSR-3296.pdf>; DESCRIPTION: Swquare Trimming Potentionmeter; HEIGHT: 10mm; MANUFACTURER_NAME: SUNTAN; MANUFACTURER_PART_NUMBER: TSR-3296W-203R
Y1 = CSTNE8M00G55Z000R0:CSTNE8M00G55Z000R0: Resonators 8.0000MHz 33pF SMD CHP Resntr Wide Temp Source: Datasheet <https://componentsearchengine.com/Datasheets/1/CSTNE8M00G55Z000R0.pdf>; DESCRIPTION: Resonators 8.0000MHz 33pF SMD CHP Resntr Wide Temp; HEIGHT: 0.8mm; MANUFACTURER_NAME: Murata Electronics; MANUFACTURER_PART_NUMBER: CSTNE8M00G55Z000R0; MOUSER_PART_NUMBER: 81-CSTNE8M00G55Z000R; MOUSER_PRICE-STOCK: https://www.mouser.com/Search/Refine.aspx?Keyword=81-CSTNE8M00G55Z000R

## Net classes
0 default: width 0.1 mm, clearance 0.102 mm
1 gnd: width 0.5 mm, clearance 0.203 mm
2 power: width 0.5 mm, clearance 0.203 mm